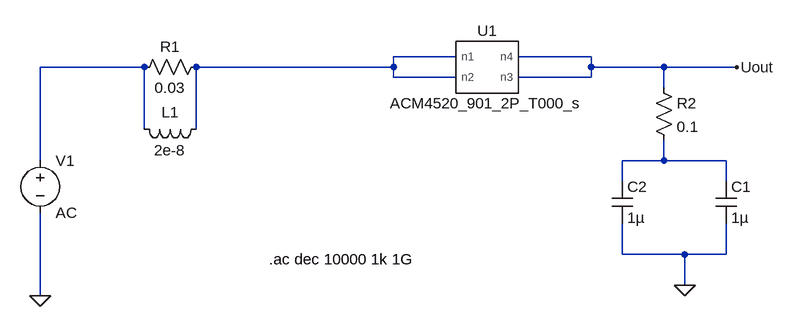
[diagram p0: schematic 01_CM-Filter_REAL.asc]
01_CM-Filter_REAL.asc, the LTspice schematic file:
Version 4
SHEET 1 1784 680
WIRE 336 -144 240 -144
WIRE 544 -144 432 -144
WIRE -144 -128 -304 -128
WIRE 240 -128 240 -144
WIRE 240 -128 -64 -128
WIRE 544 -128 544 -144
WIRE 656 -128 544 -128
WIRE 768 -128 656 -128
WIRE 240 -112 240 -128
WIRE 336 -112 240 -112
WIRE 544 -112 544 -128
WIRE 544 -112 432 -112
WIRE 656 -96 656 -128
WIRE -144 -32 -144 -128
WIRE -64 -32 -64 -128
WIRE -304 16 -304 -128
WIRE 656 16 656 -16
WIRE 656 16 592 16
WIRE 752 16 656 16
WIRE 592 48 592 16
WIRE 752 48 752 16
WIRE 592 160 592 112
WIRE 688 160 592 160
WIRE 752 160 752 112
WIRE 752 160 688 160
WIRE 688 208 688 160
WIRE -304 224 -304 96
FLAG 768 -128 Uout
FLAG 688 208 0
FLAG -304 224 0
SYMBOL voltage -304 0 R0
SYMATTR InstName V1
SYMATTR Value AC
SYMBOL ACM4520_901_2P_T000_s 384 -128 R0
SYMATTR InstName U1
SYMBOL cap 736 48 R0
SYMATTR InstName C1
SYMATTR Value 1µ
SYMATTR SpiceLine V=50 Irms=0 Rser=0.0056 Lser=600p mfg="Würth Elektronik" pn="885012208093 WCAP-CSGP 1206" type="X7R"
SYMBOL res -48 -144 R90
WINDOW 0 0 56 VBottom 2
WINDOW 3 32 56 VTop 2
SYMATTR InstName R1
SYMATTR Value 0.03
SYMBOL ind -48 -48 R90
WINDOW 0 5 56 VBottom 2
WINDOW 3 32 56 VTop 2
SYMATTR InstName L1
SYMATTR Value 2e-8
SYMBOL res 640 -112 R0
SYMATTR InstName R2
SYMATTR Value 0.1
SYMBOL cap 576 48 R0
SYMATTR InstName C2
SYMATTR Value 1µ
SYMATTR SpiceLine V=50 Irms=0 Rser=0.0056 Lser=600p mfg="Würth Elektronik" pn="885012208093 WCAP-CSGP 1206" type="X7R"
TEXT 48 168 Left 2 !.ac dec 10000 1k 1G

The netlist it stands for:
* 01_CM-Filter_REAL.asc
V1 N002 0 AC
XU1 N001 N001 Uout Uout ACM4520_901_2P_T000_s  ; pins n1 n2 n3 n4
C1 N003 0 1µ V=50 Irms=0 Rser=0.0056 Lser=600p mfg="Würth Elektronik" pn="885012208093 WCAP-CSGP 1206" type="X7R"
R1 N001 N002 0.03
L1 N001 N002 2e-8
R2 Uout N003 0.1
C2 N003 0 1µ V=50 Irms=0 Rser=0.0056 Lser=600p mfg="Würth Elektronik" pn="885012208093 WCAP-CSGP 1206" type="X7R"
.ac dec 10000 1k 1G
.lib C:\Work\PraxismodulHSLU\Praxismodul\08_Auslegungen\06_Simulatonsdaten\00_Spice_Daten\acm4520_901_2p_t000_s.mod
.backanno
.end